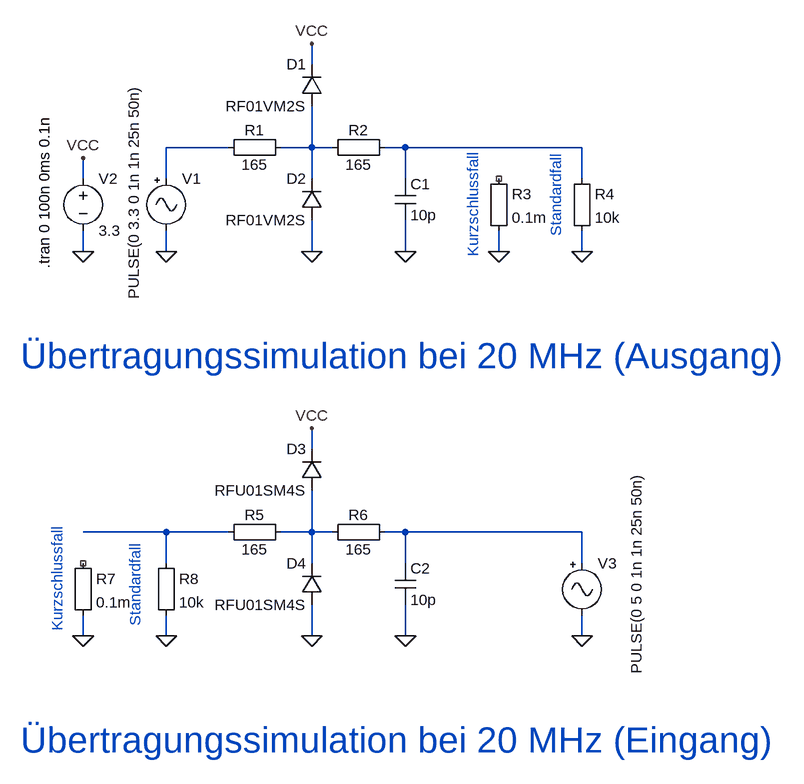
[diagram p0: schematic Datenuebertragung.asc]
Datenuebertragung.asc, the LTspice schematic file:
Version 4
SHEET 1 976 1012
WIRE 192 -64 192 -96
WIRE 64 64 -32 64
WIRE 192 64 192 0
WIRE 192 64 144 64
WIRE 224 64 192 64
WIRE 336 64 304 64
WIRE 608 64 336 64
WIRE -160 112 -160 80
WIRE -32 112 -32 64
WIRE 192 112 192 64
WIRE 336 112 336 64
WIRE 608 112 608 64
WIRE -160 224 -160 192
WIRE -32 224 -32 192
WIRE 192 224 192 176
WIRE 336 224 336 176
WIRE 480 224 480 192
WIRE 608 224 608 192
WIRE 192 528 192 496
WIRE -32 656 -160 656
WIRE 64 656 -32 656
WIRE 192 656 192 592
WIRE 192 656 144 656
WIRE 224 656 192 656
WIRE 336 656 304 656
WIRE 608 656 336 656
WIRE -32 704 -32 656
WIRE 192 704 192 656
WIRE 336 704 336 656
WIRE 608 704 608 656
WIRE -160 816 -160 784
WIRE -32 816 -32 784
WIRE 192 816 192 768
WIRE 336 816 336 768
WIRE 608 816 608 784
FLAG -32 224 0
FLAG 192 224 0
FLAG -160 224 0
FLAG -160 80 VCC
FLAG 192 -96 VCC
FLAG 336 224 0
FLAG 480 224 0
FLAG 608 224 0
FLAG -32 816 0
FLAG 192 816 0
FLAG 192 496 VCC
FLAG 336 816 0
FLAG 608 816 0
FLAG -160 816 0
SYMBOL Misc\\signal -32 96 R0
WINDOW 3 -50 -129 VRight 2
WINDOW 123 0 0 Left 2
WINDOW 39 0 0 Left 2
SYMATTR InstName V1
SYMATTR Value PULSE(0 3.3 0 1n 1n 25n 50n)
SYMBOL voltage -160 96 R0
WINDOW 123 0 0 Left 2
WINDOW 39 0 0 Left 2
SYMATTR InstName V2
SYMATTR Value 3.3
SYMBOL Misc\\EuropeanResistor 160 48 R90
WINDOW 0 5 56 VBottom 2
WINDOW 3 27 56 VTop 2
SYMATTR InstName R1
SYMATTR Value 165
SYMBOL Misc\\EuropeanResistor 320 48 R90
WINDOW 0 5 56 VBottom 2
WINDOW 3 27 56 VTop 2
SYMATTR InstName R2
SYMATTR Value 165
SYMBOL cap 320 112 R0
SYMATTR InstName C1
SYMATTR Value 10p
SYMBOL diode 208 0 R180
WINDOW 0 24 64 Left 2
WINDOW 3 24 0 Left 2
SYMATTR InstName D1
SYMATTR Value RF01VM2S
SYMBOL diode 208 176 R180
WINDOW 0 24 64 Left 2
WINDOW 3 24 0 Left 2
SYMATTR InstName D2
SYMATTR Value RF01VM2S
SYMBOL Misc\\EuropeanResistor 464 96 R0
SYMATTR InstName R3
SYMATTR Value 0.1m
SYMBOL Misc\\EuropeanResistor 592 96 R0
SYMATTR InstName R4
SYMATTR Value 10k
SYMBOL Misc\\signal 608 688 R0
WINDOW 3 84 -124 VRight 2
WINDOW 123 0 0 Left 2
WINDOW 39 0 0 Left 2
SYMATTR InstName V3
SYMATTR Value PULSE(0 5 0 1n 1n 25n 50n)
SYMBOL Misc\\EuropeanResistor 160 640 R90
WINDOW 0 5 56 VBottom 2
WINDOW 3 27 56 VTop 2
SYMATTR InstName R5
SYMATTR Value 165
SYMBOL Misc\\EuropeanResistor 320 640 R90
WINDOW 0 5 56 VBottom 2
WINDOW 3 27 56 VTop 2
SYMATTR InstName R6
SYMATTR Value 165
SYMBOL cap 320 704 R0
SYMATTR InstName C2
SYMATTR Value 10p
SYMBOL diode 208 592 R180
WINDOW 0 24 64 Left 2
WINDOW 3 24 0 Left 2
SYMATTR InstName D3
SYMATTR Value RFU01SM4S
SYMBOL diode 208 768 R180
WINDOW 0 24 64 Left 2
WINDOW 3 24 0 Left 2
SYMATTR InstName D4
SYMATTR Value RFU01SM4S
SYMBOL Misc\\EuropeanResistor -176 688 R0
SYMATTR InstName R7
SYMATTR Value 0.1m
SYMBOL Misc\\EuropeanResistor -48 688 R0
SYMATTR InstName R8
SYMATTR Value 10k
TEXT -220 14 VRight 2 !.tran 0 100n 0ms 0.1n
TEXT -256 384 Left 5 ;Übertragungssimulation bei 20 MHz (Ausgang)
TEXT 440 72 VRight 2 ;Kurzschlussfall
TEXT 568 72 VRight 2 ;Standardfall
TEXT -256 976 Left 5 ;Übertragungssimulation bei 20 MHz (Eingang)
TEXT -200 648 VRight 2 ;Kurzschlussfall
TEXT -80 672 VRight 2 ;Standardfall

The netlist it stands for:
* Datenuebertragung.asc
V1 N001 0 PULSE(0 3.3 0 1n 1n 25n 50n)
V2 VCC 0 3.3
R1 N002 N001 165
R2 N003 N002 165
C1 N003 0 10p
D1 N002 VCC RF01VM2S
D2 0 N002 RF01VM2S
R3 NC_01 0 0.1m
R4 N003 0 10k
V3 N006 0 PULSE(0 5 0 1n 1n 25n 50n)
R5 N005 N004 165
R6 N006 N005 165
C2 N006 0 10p
D3 N005 VCC RFU01SM4S
D4 0 N005 RFU01SM4S
R7 NC_02 0 0.1m
R8 N004 0 10k
.model D D
.lib standard.dio
.tran 0 100n 0ms 0.1n
* Übertragungssimulation bei 20 MHz (Ausgang)
* Kurzschlussfall
* Standardfall
* Übertragungssimulation bei 20 MHz (Eingang)
* Kurzschlussfall
* Standardfall
.backanno
.end